# Altium schematic sheet connector-right3.SchDoc
size Letter; CompanyName: Brinton Engineering, LLC; Address1: 3479 Edison Way; Address2: Menlo Park CA 94025; Address3: +1 (877) 778-8435; Address4: brintonengineering.com; Revision: 1; SheetNumber: 1; SheetTotal: 1
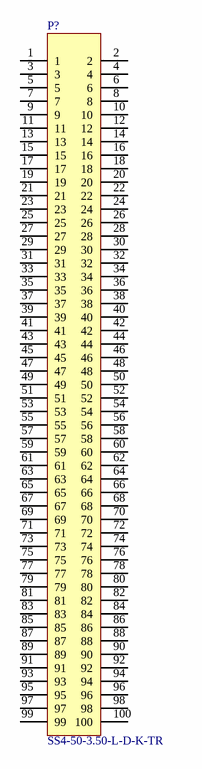
[diagram p0: connector-right3.SchDoc]

## Parts
P?  SS4-50-3.50-L-D-K-TR  [SS4-50-3.50-L-D-K-TR]

## Nets

Not connected (* = marked no-connect by the designer): P? 1 2 3 4 5 6 7 8 9 10 11 12 13 14 15 16 17 18 19 20 21 22 23 24 25 26 27 28 29 30 31 32 33 34 35 36 37 38 39 40 41 42 43 44 45 46 47 48 49 50 51 52 53 54 55 56 57 58 59 60 61 62 63 64 65 66 67 68 69 70 71 72 73 74 75 76 77 78 79 80 81 82 83 84 85 86 87 88 89 90 91 92 93 94 95 96 97 98 99 100

## Notes on the sheet
- Title
- Engineer
- Revision
- Drawn By
- Checked By
- Date
- Sheet
- of

## Library data of the parts
P? = SS4-50-3.50-L-D-K-TR: 0.4mm Socket Strip Assembly; 100-pin; Manufacturer: Samtec; Manufacturer P/N: SS4-50-3.50-L-D-K-TR